# Altium schematic sheet XR76208ELTR-F1_XR76208ELTR-F.schdoc
size 124 x 99 mm
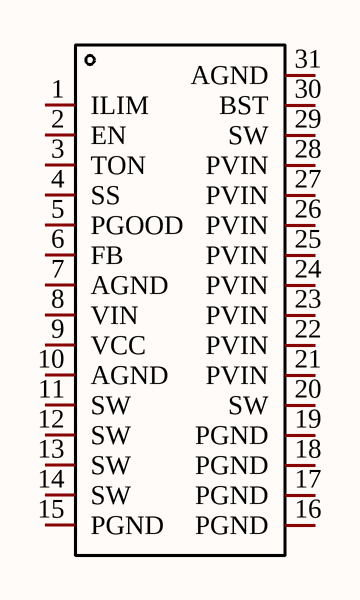
[diagram p0: XR76208ELTR-F1_XR76208ELTR-F.schdoc]

## Parts
U?  XR76208ELTR-F  [QFN-30_L5.0-W5.0-P0.50-BL_XR76208XX]  (value not drawn)

## Nets

Not connected (* = marked no-connect by the designer): U? 1(ILIM) 2(EN) 3(TON) 4(SS) 5(PGOOD) 6(FB) 7(AGND) 8(VIN) 9(VCC) 10(AGND) 11(SW) 12(SW) 13(SW) 14(SW) 15(PGND) 16(PGND) 17(PGND) 18(PGND) 19(PGND) 20(SW) 21(PVIN) 22(PVIN) 23(PVIN) 24(PVIN) 25(PVIN) 26(PVIN) 27(PVIN) 28(PVIN) 29(SW) 30(BST) 31(AGND)

## Library data of the parts
U? = XR76208ELTR-F: Manufacturer: MaxLinear(迈凌); Add into BOM: yes; Function: 降压型; Output Type: 可调; Input Voltage: 5V~40V; Output Voltage: 600mV~40V; Output Current (Max): 8A; Switching Frequency: 800kHz; Synchronous Rectification: 是; Number of Outputs: 1; Topology: 降压式; Switch tube (built-in/external): 内置; Symbol: XR76208ELTR-F; Device: XR76208ELTR-F; LCSC Part Name: XR76208ELTR-F; Supplier Part: C555356; Manufacturer Part: XR76208ELTR-F; Supplier Footprint: QFN-30(5x5); JLCPCB Part Class: Extended Part; Datasheet: https://atta.szlcsc.com/upload/public/pdf/source/20200515/C555356_E3973E51DE48FBA6B28D55F233E237FF.pdf; Supplier: LCSC; Convert to PCB: yes; Operating Temperature: -40℃~+125℃@(TJ)